# Altium schematic sheet CC2530.SchDoc
size A4
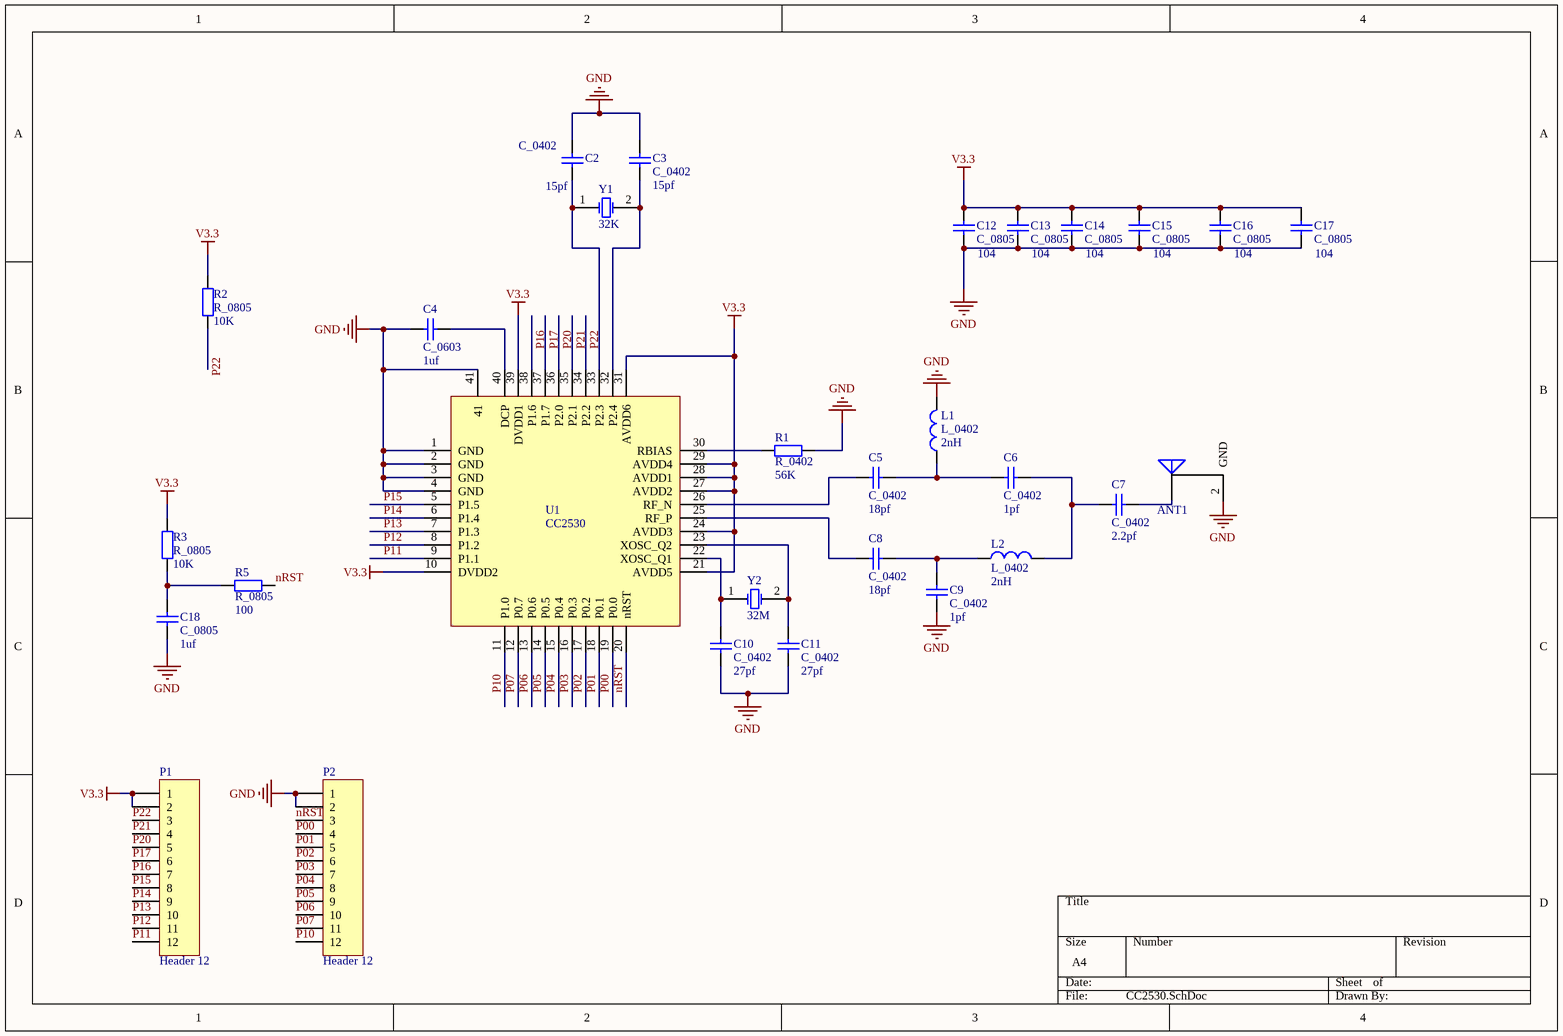
[diagram p0: CC2530.SchDoc]

## Parts
ANT1  ANT  [ANT]  (value not drawn)
C2  C_0402  value 15pf  [M_0402]
C3  C_0402  value 15pf  [M_0402]
C4  C_0603  value 1uf  [M_0402]
C5  C_0402  value 18pf  [M_0402]
C6  C_0402  value 1pf  [M_0402]
C7  C_0402  value 2.2pf  [M_0402]
C8  C_0402  value 18pf  [M_0402]
C9  C_0402  value 1pf  [M_0402]
C10  C_0402  value 27pf  [M_0402]
C11  C_0402  value 27pf  [M_0402]
C12  C_0805  value 104  [M_0402]
C13  C_0805  value 104  [M_0402]
C14  C_0805  value 104  [M_0402]
C15  C_0805  value 104  [M_0402]
C16  C_0805  value 104  [M_0402]
C17  C_0805  value 104  [M_0402]
C18  C_0805  value 1uf  [M_0402]
L1  L_0402  value 2nH  [M_0402]
L2  L_0402  value 2nH  [M_0402]
P1  Header 12  [Header-2.0]
P2  Header 12  [Header-2.0]
R1  R_0402  value 56K  [M_0402]
R2  R_0805  value 10K  [M_0402]
R3  R_0805  value 10K  [M_0402]
R5  R_0805  value 100  [M_0402]
U1  CC2530  [QFN40]
Y1  32K  [XTAL_32K_2P]
Y2  32M  [XTAL_32M_SMD]

## Nets
GND: ANT1.2(GND) C2.2 C3.2 C4.2 C9.1 C10.1 C11.1 C12.1 C13.1 C14.1 C15.1 C16.1 C17.1 C18.1 L1.2 P2.1 P2.2 R1.2 U1.1(GND) U1.2(GND) U1.3(GND) U1.4(GND) U1.41
V3.3: C12.2 C13.2 C14.2 C15.2 C16.2 C17.2 P1.1 P1.2 R2.2 R3.2 U1.10(DVDD2) U1.21(AVDD5) U1.24(AVDD3) U1.27(AVDD2) U1.28(AVDD1) U1.29(AVDD4) U1.31(AVDD6) U1.39(DVDD1)
nRST: P2.3 R5.2 U1.20(nRST)
P00: P2.4 U1.19(P0.0)
P01: P2.5 U1.18(P0.1)
P02: P2.6 U1.17(P0.2)
P03: P2.7 U1.16(P0.3)
P04: P2.8 U1.15(P0.4)
P05: P2.9 U1.14(P0.5)
P06: P2.10 U1.13(P0.6)
P07: P2.11 U1.12(P0.7)
P10: P2.12 U1.11(P1.0)
P11: P1.12 U1.9(P1.1)
P12: P1.11 U1.8(P1.2)
P13: P1.10 U1.7(P1.3)
P14: P1.9 U1.6(P1.4)
P15: P1.8 U1.5(P1.5)
P16: P1.7 U1.38(P1.6)
P17: P1.6 U1.37(P1.7)
P20: P1.5 U1.36(P2.0)
P21: P1.4 U1.35(P2.1)
P22: P1.3 R2.1 U1.34(P2.2)
NetANT1_1: ANT1.1(A) C7.2
NetC2_1: C2.1 U1.33(P2.3) Y1.1(OSC1)
NetC3_1: C3.1 U1.32(P2.4) Y1.2(OSC2)
NetC4_1: C4.1 U1.40(DCP)
NetC5_1: C5.1 U1.26(RF_N)
NetC5_2: C5.2 C6.1 L1.1
NetC6_2: C6.2 C7.1 L2.2
NetC8_1: C8.1 U1.25(RF_P)
NetC8_2: C8.2 C9.2 L2.1
NetC10_2: C10.2 U1.22(XOSC_Q1) Y2.1(OSC1)
NetC11_2: C11.2 U1.23(XOSC_Q2) Y2.2(OSC2)
NetC18_2: C18.2 R3.1 R5.1
NetR1_1: R1.1 U1.30(RBIAS)

## Library data of the parts
C2-C4 C10 C11 = C_0805
P1 P2 = Header 12: Header, 12-Pin; LatestRevisionDate: 17-Jul-2002; LatestRevisionNote: Re-released for DXP Platform.; Publisher: Altium Limited
R1 = R_0805
Y1 = X_32K_2P
Y2 = X_32M_SMD